# Altium schematic sheet BLDCV1.SchDoc
size A3
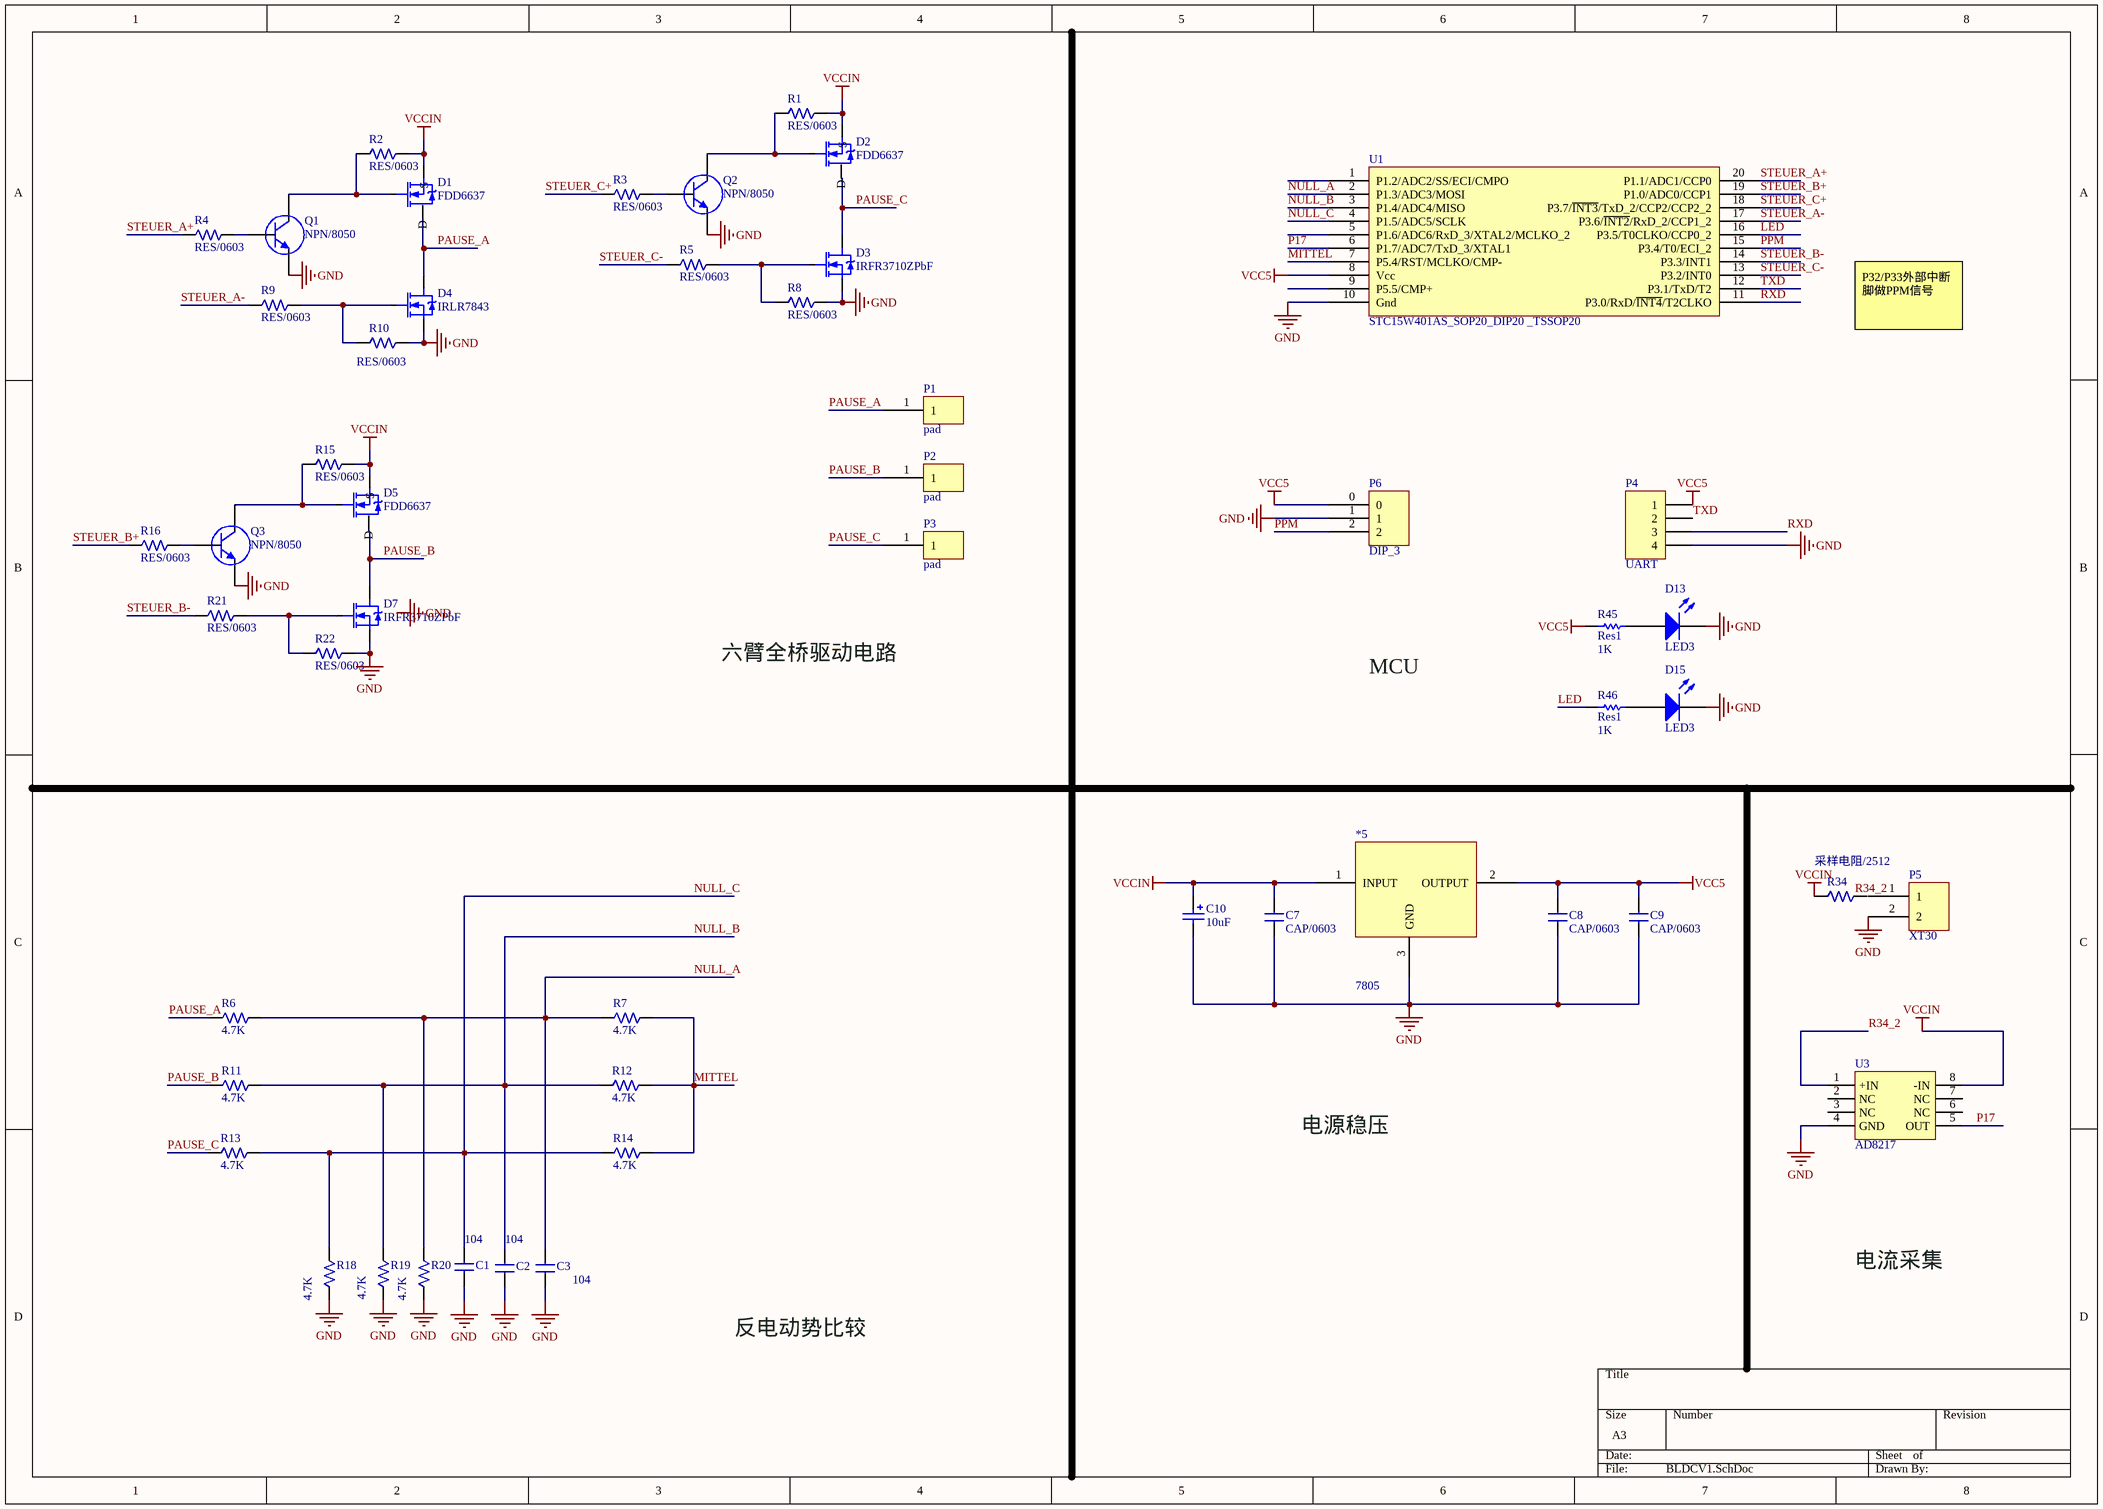
[diagram p0: BLDCV1.SchDoc]

## Parts
*5  7805  [IRFR3710ZPbF_D-Pak]
C1  104  [0603]
C2  104  [0603]
C3  104  [0603]
C7  CAP/0603  [LED_DIP]
C8  CAP/0603  [LC-0603_C]
C9  CAP/0603  [LED_DIP]
C10  10uF  [贴片铝电解6.3mm(16V 220U)]
D1  FDD6637  [IRFR3710ZPbF_D-Pak]
D2  FDD6637  [IRFR3710ZPbF_D-Pak]
D3  IRFR3710ZPbF  [IRFR3710ZPbF_D-Pak]
D4  IRLR7843  [IRFR3710ZPbF_D-Pak]
D5  FDD6637  [IRFR3710ZPbF_D-Pak]
D7  IRFR3710ZPbF  [IRFR3710ZPbF_D-Pak]
D13  LED3  [LC-0603_LED_S1]
D15  LED3  [LC-0603_LED_S1]
P1  pad  [PAD]
P2  pad  [PAD]
P3  pad  [PAD]
P4  UART  [HDR1X4]
P5  XT30  [电源口]
P6  DIP_3  [DIP_3]
Q1  NPN/8050  [NPN/8050]
Q2  NPN/8050  [NPN/8050]
Q3  NPN/8050  [NPN/8050]
R1  RES/0603  [0603]
R2  RES/0603  [0603]
R3  RES/0603  [0603]
R4  RES/0603  [0603]
R5  RES/0603  [0603]
R6  4.7K  [0603]
R7  4.7K  [0603]
R8  RES/0603  [0603]
R9  RES/0603  [0603]
R10  RES/0603  [0603]
R11  4.7K  [0603]
R12  4.7K  [0603]
R13  4.7K  [0603]
R14  4.7K  [0603]
R15  RES/0603  [0603]
R16  RES/0603  [0603]
R18  4.7K  [0603]
R19  4.7K  [0603]
R20  4.7K  [0603]
R21  RES/0603  [0603]
R22  RES/0603  [0603]
R34  采样电阻/2512  [2512]
R45  Res1  value 1K  [LC-0603_R]
R46  Res1  value 1K  [LC-0603_R]
U1  STC15W401AS_SOP20_DIP20 _TSSOP20  [TSSOP20]
U3  AD8217  [LC-MSOP-8]

## Nets
GND: *5.3(GND) C1.1 C2.1 C3.1 C7.1 C8.1 C9.1 C10.2 D3.2(S) D4.2(S) D7.2(S) D13.2(K) D15.2(K) P4.4 P5.2 P6.1 Q1.2(E) Q2.2(E) Q3.2(E) R8.2 R10.2 R18.1 R19.1 R20.1 R22.2 U1.10(Gnd) U3.4(GND)
VCC5: *5.2(OUTPUT) C8.2 C9.2 P4.1 P6.0 R45.1 U1.8(Vcc)
VCCIN: *5.1(INPUT) C7.2 C10.1 D1.2(S) D2.2(S) D5.2(S) R1.2 R2.2 R15.2 R34.1 U3.8(-IN)
LED: R46.1 U1.16(P3.5/T0CLKO/CCP0_2)
MITTEL: R7.2 R12.2 R14.2 U1.7(P5.4/RST/MCLKO/CMP-)
NULL_A: C3.2 R6.2 R7.1 R20.2 U1.2(P1.3/ADC3/MOSI)
NULL_B: C2.2 R11.2 R12.1 R19.2 U1.3(P1.4/ADC4/MISO)
NULL_C: C1.2 R13.2 R14.1 R18.2 U1.4(P1.5/ADC5/SCLK)
P17: U1.6(P1.7/ADC7/TxD_3/XTAL1) U3.5(OUT)
PAUSE_A: D1.3(D) D4.3(D) P1.1 R6.1
PAUSE_B: D5.3(D) D7.3(D) P2.1 R11.1
PAUSE_C: D2.3(D) D3.3(D) P3.1 R13.1
PPM: P6.2 U1.15(P3.4/T0/ECI_2)
R34_2: U3.1(+IN)
RXD: P4.3 U1.11(P3.0/RxD/~{INT4}/T2CLKO)
STEUER_A+: R4.1 U1.20(P1.1/ADC1/CCP0)
STEUER_A-: R9.1 U1.17(P3.6/~{INT2}/RxD_2/CCP1_2)
STEUER_B+: R16.1 U1.19(P1.0/ADC0/CCP1)
STEUER_B-: R21.1 U1.14(P3.3/INT1)
STEUER_C+: R3.1 U1.18(P3.7/~{INT3}/TxD_2/CCP2/CCP2_2)
STEUER_C-: R5.1 U1.13(P3.2/INT0)
TXD: P4.2 U1.12(P3.1/TxD/T2)
NetD1_1: D1.1(G) Q1.3(C) R2.1
NetD2_1: D2.1(G) Q2.3(C) R1.1
NetD3_1: D3.1(G) R5.2 R8.1
NetD4_1: D4.1(G) R9.2 R10.1
NetD5_1: D5.1(G) Q3.3(C) R15.1
NetD7_1: D7.1(G) R21.2 R22.1
NetD13_1: D13.1(A) R45.2
NetD15_1: D15.1(A) R46.2
NetQ1_1: Q1.1(B) R4.2
NetQ2_1: Q2.1(B) R3.2
NetQ3_1: Q3.1(B) R16.2

Not connected (* = marked no-connect by the designer): P5 1; R34 2; U1 1(P1.2/ADC2/SS/ECI/CMPO) 5(P1.6/ADC6/RxD_3/XTAL2/MCLKO_2) 9(P5.5/CMP+); U3 2(NC) 3(NC) 6(NC) 7(NC)

## Notes on the sheet
- P32/P33外部中断脚做PPM信号
- 六臂全桥驱动电路
- MCU
- 电源稳压
- 电流采集
- 反电动势比较
- Labels drawn without touching a wire or pin: GND, R34_2

## Library data of the parts
C1-C3 = CAP/0603
C10 = Cap Pol1: Polarized Capacitor (Radial); Value: 100pF; Published: 8-Jun-2000; LatestRevisionDate: 17-Jul-2002; LatestRevisionNote: Re-released for DXP Platform.; PackageReference: RB7.6-15; Publisher: Altium Limited; PackageDescription: Polarized Capacitor (Radial); 2 Leads
D4 = IRFR3710ZPbF
D13 D15 = LED3: Typical BLUE SiC LED; Published: 8-Jun-2000; LatestRevisionDate: 17-Dec-2003; LatestRevisionNote: PCB Footprint replaced.; DatasheetVersion: 16-Apr-2002; PackageVersion: 16-Apr-2002; PackageReference: 3.5X2.8X1.9; Publisher: Altium Limited; PackageDescription: SM LED; 2 C-Bend Leads; Body 3.5 x 2.8 x 1.9 mm, inc leads (LxWxH typ)
P4 = Header 4: Header, 4-Pin; LatestRevisionDate: 17-Jul-2002; LatestRevisionNote: Re-released for DXP Platform.; Publisher: Altium Limited
R6 R7 R11-R14 R18-R20 = RES/0603
R34 = RES/2512
R45 R46 = Res1: Resistor; Published: 8-Jun-2000; LatestRevisionDate: 17-Jul-2002; LatestRevisionNote: Re-released for DXP Platform.; PackageReference: AXIAL-0.3; Publisher: Altium Limited; PackageDescription: Axial Device, Thru-Hole; 2 Leads; 0.3 in Pin Spacing